# EAGLE design board (EAGLE 6.2)
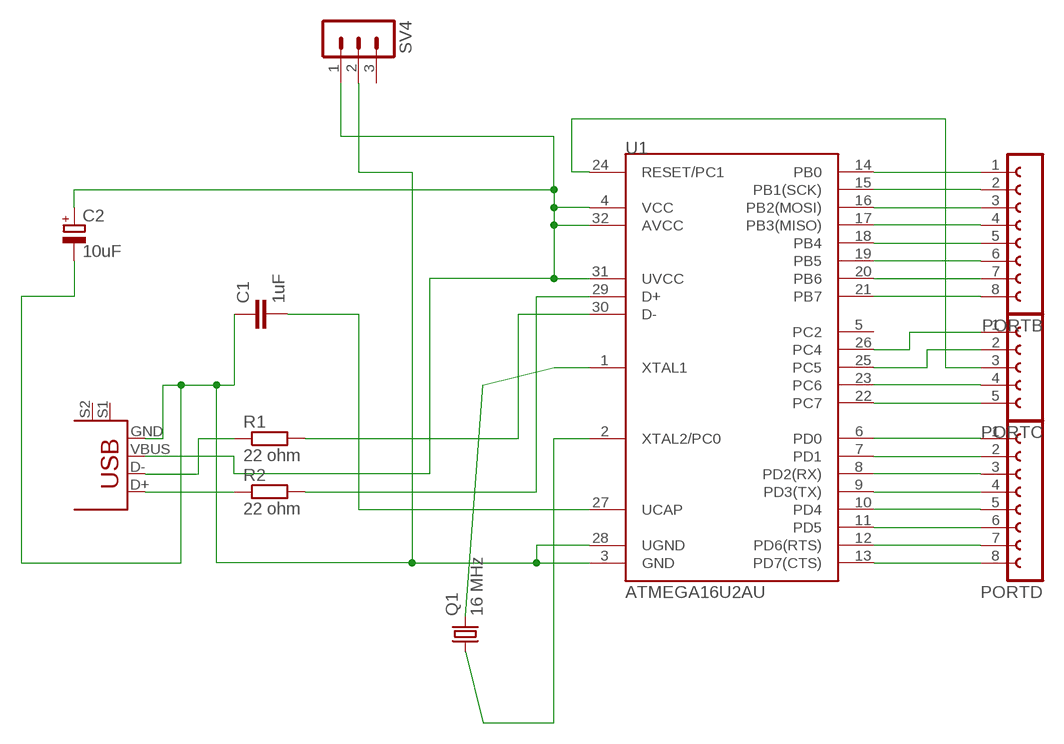
[diagram p0: schematic, sheet 1]

## Parts
C1  1uF  C-EU025-024X044  [C025-024X044]
C2  10uF  CPOL-EUE1.8-4  [E1,8-4]
PORTB  FE08-1  [FE08]
PORTC  FE05-1  [FE05-1]
PORTD  FE08-1  [FE08]
Q1  16 MHz  CRYSTALHC49S  [HC49/S]
R1  22 ohm  R-EU_0207/5V  [0207/5V]
R2  22 ohm  R-EU_0207/5V  [0207/5V]
SV4  MA03-1  [MA03-1]
U1  ATMEGA16U2AU  ATMEGA8U2AU  [TQFP32-08]
U$2  USB+SHIELD  [USB-B-PTH]

## Nets
N$1: R1.1 U$2.D-
N$2: PORTD.6 U1.11(PD5)
N$3: R2.1 U$2.D+
N$4: R1.2 U1.30(D-)
N$5: PORTB.2 U1.15(PB1(SCK))
N$6: C2.+ SV4.1 U1.4(VCC) U1.31(UVCC) U1.32(AVCC) U$2.VBUS
N$7: PORTB.4 U1.17(PB3(MISO))
N$8: Q1.2 U1.1(XTAL1)
N$9: Q1.1 U1.2(XTAL2/PC0)
N$10: C1.2 U1.27(UCAP)
N$11: R2.2 U1.29(D+)
N$12: PORTB.1 U1.14(PB0)
N$14: PORTB.5 U1.18(PB4)
N$15: PORTB.6 U1.19(PB5)
N$16: PORTB.7 U1.20(PB6)
N$17: PORTB.8 U1.21(PB7)
N$18: PORTD.8 U1.13(PD7(CTS))
N$19: PORTC.2 U1.25(PC5)
N$20: PORTC.1 U1.26(PC4)
N$21: PORTC.4 U1.23(PC6)
N$22: PORTC.5 U1.22(PC7)
N$23: PORTD.7 U1.12(PD6(RTS))
N$25: PORTD.5 U1.10(PD4)
N$26: PORTD.4 U1.9(PD3(TX))
N$27: PORTD.3 U1.8(PD2(RX))
N$28: PORTD.2 U1.7(PD1)
N$29: PORTD.1 U1.6(PD0)
N$30: C1.1 C2.- SV4.2 U1.3(GND) U1.28(UGND) U$2.GND
N$31: PORTB.3 U1.16(PB2(MOSI))
N$33: PORTC.3 U1.24(RESET/PC1)
Unconnected: SV4.3 U1.5(PC2) U$2.S1 U$2.S2

## Library data of the parts
C1 = rcl:C-EU: CAPACITOR, European symbol
C2 = rcl:CPOL-EU: POLARIZED CAPACITOR, European symbol
PORTB PORTD = con-lsta:FE08-1: FEMALE HEADER; OC_FARNELL: unknown; OC_NEWARK: unknown
PORTC = con-lsta:FE05-1: FEMALE HEADER; OC_FARNELL: unknown; OC_NEWARK: unknown
Q1 = crystal:CRYSTAL: CRYSTAL; OC_FARNELL: 1667008; OC_NEWARK: unknown
R1 R2 = rcl:R-EU_: RESISTOR, European symbol
SV4 = con-lstb:MA03-1: PIN HEADER; OC_FARNELL: unknown; OC_NEWARK: unknown
U1 = SparkFun:ATMEGA8U2: Atmel 8-bit Microcontroller with 8/16/32K Bystes of ISP Flash and USB Controller. ATmega8U2, ATmega16U2, and ATmega32U2
U$2 = SparkFun:USB+SHIELD: USB+Shield USB connector with shield pins connectable

## Board
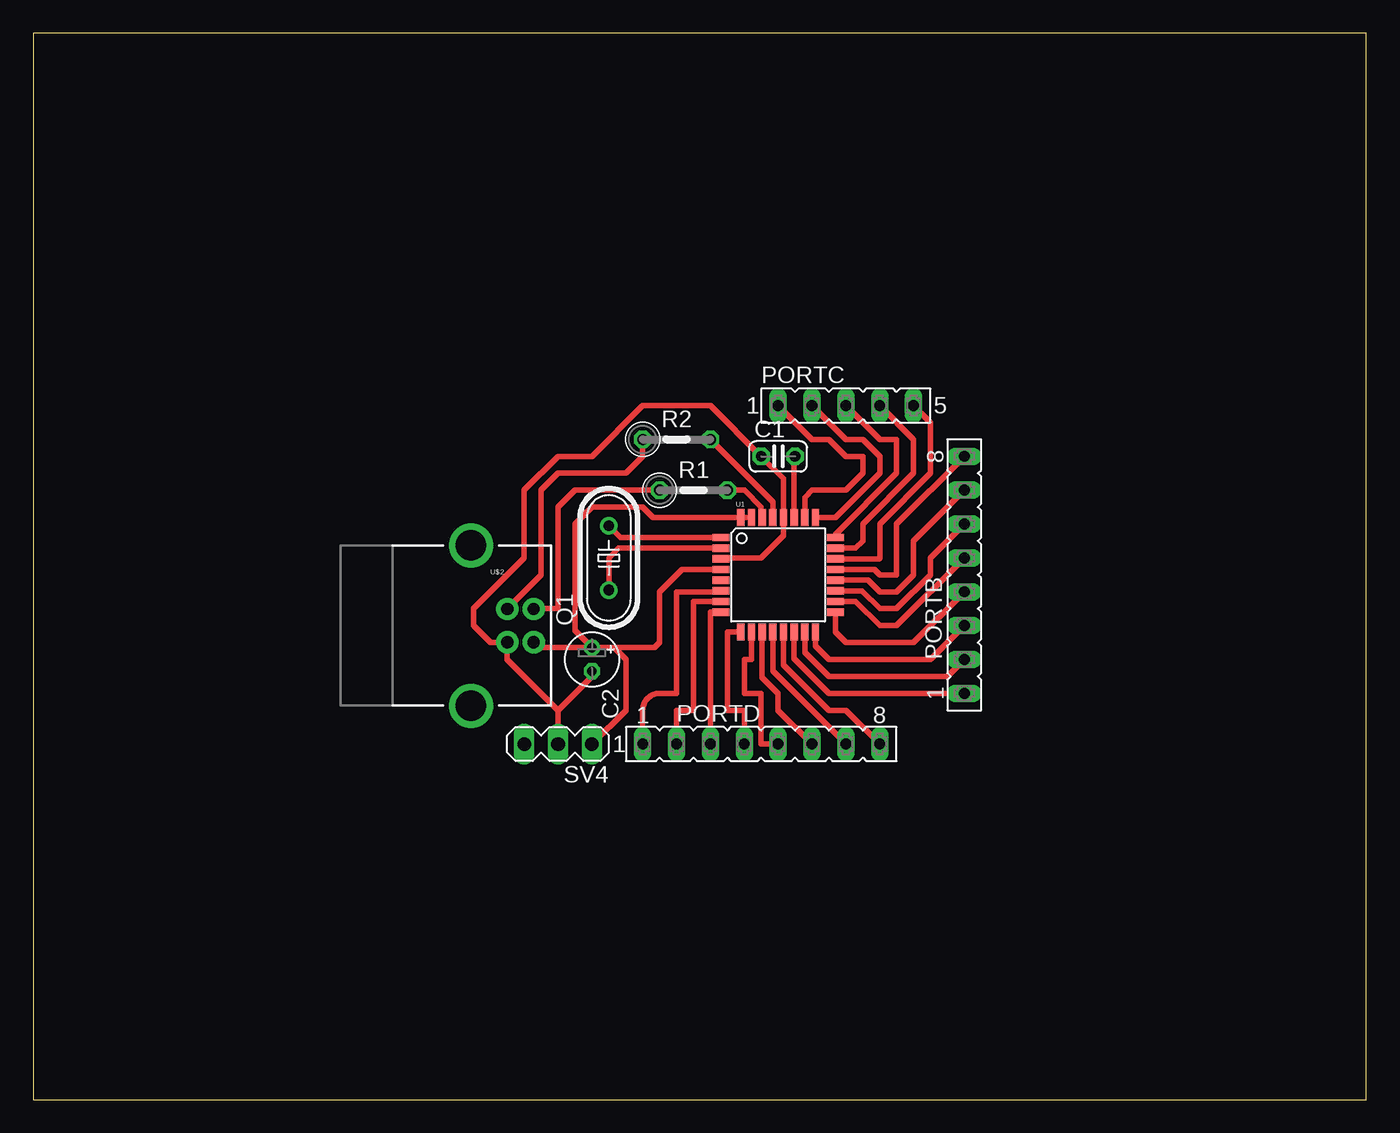
[diagram p1: board, top side]

Size 100 x 80 mm. Coordinates in mm from the lower left corner, seen from the top.
Outline: 0,0 100,0 100,80 0,80 0,0
Copper layers (1*16): Top 0.035mm / dielectric 1.5mm / Bottom 0.035mm
Design rules: minimum track width 10mil, minimum drill 24mil, track to track 8mil, track to pad 8mil, pad to pad 8mil, via to via 8mil, smd to smd 8mil, copper to edge 40mil, drill to drill 8mil, minimum pad ring 10mil, minimum via ring 8mil, stop-mask expansion 4mil, vias tented up to drill 0mil, thermal gap 10mil

### Footprints (pad centres in the part's own frame; a part is rotated, then mirrored left to right if it is on the bottom)
C025-024X044 = drill 0.813 octagon: 1 -1.27,0; 2 1.27,0
E1,8-4 = drill 0.711 pad 1.168: + -0.889,0 | drill 0.711 pad 1.168 octagon: - 0.889,0
FE08 = drill 0.813 long: 1 -8.89,0; 2 -6.35,0; 3 -3.81,0; 4 -1.27,0; 5 1.27,0; 6 3.81,0; 7 6.35,0; 8 8.89,0
FE05-1 = drill 0.813 long: 1 -5.08,0; 2 -2.54,0; 3 0,0; 4 2.54,0; 5 5.08,0
HC49/S = drill 0.813: 1 -2.413,0; 2 2.413,0
0207/5V = drill 0.813 octagon: 1 -2.54,0; 2 2.54,0
MA03-1 = drill 1.016 long: 1 -2.54,0; 2 0,0; 3 2.54,0
TQFP32-08 = smd 1.27 x 0.559: 1 -4.293,2.8; 2 -4.293,2; 3 -4.293,1.2; 4 -4.293,0.4; 5 -4.293,-0.4; 6 -4.293,-1.2; 7 -4.293,-2; 8 -4.293,-2.8; 17 4.293,-2.8; 18 4.293,-2; 19 4.293,-1.2; 20 4.293,-0.4; 21 4.293,0.4; 22 4.293,1.2; 23 4.293,2; 24 4.293,2.8 | smd 0.559 x 1.27: 9 -2.8,-4.293; 10 -2,-4.293; 11 -1.2,-4.293; 12 -0.4,-4.293; 13 0.4,-4.293; 14 1.2,-4.293; 15 2,-4.293; 16 2.8,-4.293; 25 2.8,4.293; 26 2,4.293; 27 1.2,4.293; 28 0.4,4.293; 29 -0.4,4.293; 30 -1.2,4.293; 31 -2,4.293; 32 -2.8,4.293
USB-B-PTH = drill 0.914 pad 1.676: D+ 0,1.25; D- 1.981,1.25; GND 0,-1.25; VBUS 1.981,-1.25 | drill 2.286: S1 -2.718,-6.02; S2 -2.718,6.02

### Placement (x,y rotation side)
C1  55.88,48.26 0 top
C2  41.91,33.02 270 top
PORTB  69.85,39.37 90 top
PORTC  60.96,52.07 0 top
PORTD  54.61,26.67 0 top
Q1  43.18,40.64 90 top
R1  49.53,45.72 0 top
R2  48.26,49.53 0 top
SV4  39.37,26.67 180 top
U1  55.88,39.37 0 top
U$2  35.56,35.56 0 top

### Tracks (layer width: path | path; a pad name or v marks a point on that pad's centre or on a via)
N$1
  Top 0.406: U$2.D- 37.56,36.83 39.37,36.83 39.37,44.45 40.64,45.72 R1.1
N$2
  Top 0.406: U1.11 54.68,31.68 55.88,30.48 55.88,29.21 PORTD.6
N$3
  Top 0.406: U$2.D+ 38.1,39.35 38.1,45.72 39.37,46.99 44.45,46.99 45.72,48.26 R2.1
N$4
  Top 0.406: R1.2 53.34,45.72 54.61,44.45 54.61,43.73 U1.30
N$5
  Top 0.406: U1.15 57.88,33.56 59.69,31.75 68.58,31.75 PORTB.2
N$6
  Top 0.406: SV4.1 44.45,29.21 44.45,33.02 43.56,33.91 C2.+ | C2.+ 46.61,33.91 46.99,34.29 46.99,38.1 48.66,39.77 U1.4 | C2.+ 40.64,35.18 40.64,43.18 41.91,44.45 45.72,44.45 46.51,43.66 U1.32 U1.31 | U$2.VBUS 37.94,33.91 C2.+
N$7
  Top 0.406: U1.17 60.17,35.08 60.96,34.29 66.04,34.29 PORTB.4
N$8
  Top 0.406: Q1.2 44.06,42.17 U1.1
N$9
  Top 0.406: Q1.1 43.18,40.64 43.91,41.37 U1.2
N$10
  Top 0.406: U1.27 57.08,48.19 C1.2
N$11
  Top 0.406: R2.2 55.48,44.85 U1.29
N$12
  Top 0.406: U1.14 57.08,33.09 59.69,30.48 PORTB.1
N$14
  Top 0.406: U1.18 61.69,37.37 63.5,35.56 64.77,35.56 PORTB.5
N$15
  Top 0.406: U1.19 62.16,38.17 63.5,36.83 64.77,36.83 67.31,39.37 67.31,40.64 PORTB.6
N$16
  Top 0.406: U1.20 62.63,38.97 63.5,38.1 64.77,38.1 66.04,39.37 66.04,41.91 PORTB.7
N$17
  Top 0.406: U1.21 63.1,39.77 63.5,39.37 64.77,39.37 64.77,43.18 PORTB.8
N$18
  Top 0.406: U1.13 56.28,32.62 59.69,29.21 60.96,29.21 PORTD.8
N$19
  Top 0.406: U1.25 60.17,43.66 63.5,46.99 63.5,48.26 62.23,49.53 60.96,49.53 PORTC.2
N$20
  Top 0.406: U1.26 57.88,45.18 58.42,45.72 60.96,45.72 62.23,46.99 62.23,48.26 60.96,48.26 59.69,49.53 58.42,49.53 PORTC.1
N$21
  Top 0.406: U1.23 61.69,41.37 62.23,41.91 62.23,43.18 66.04,46.99 66.04,49.53 PORTC.4
N$22
  Top 0.406: U1.22 63.43,40.57 63.5,40.64 63.5,43.18 67.31,46.99 67.31,50.8 PORTC.5
N$23
  Top 0.406: U1.12 55.48,32.15 PORTD.7
N$25
  Top 0.406: U1.10 53.88,33.02 53.34,33.02 53.34,30.48 54.61,30.48 54.61,26.67 PORTD.5
N$26
  Top 0.406: PORTD.4 53.34,29.21 52.07,29.21 52.07,35.08 U1.9
N$27
  Top 0.406: PORTD.3 50.8,36.57 U1.8
N$28
  Top 0.406: PORTD.2 48.26,29.21 49.53,29.21 49.53,37.37 U1.7
N$29
  Top 0.406: PORTD.1 45.72,29.21 arc-90 46.99,30.48 48.26,30.48 48.26,38.1 51.59,38.1 U1.6
N$30
  Top 0.406: SV4.2 39.37,29.21 | U$2.GND 35.56,34.29 | 35.56,34.29 35.56,33.02 39.37,29.21 | C2.- 41.91,31.75 39.37,29.21 | 35.56,34.29 34.29,34.29 33.02,35.56 33.02,36.83 36.83,40.64 36.83,45.72 39.37,48.26 41.91,48.26 45.72,52.07 50.8,52.07 C1.1 56.28,46.59 U1.28 56.28,42.31 54.61,40.64 51.66,40.64 U1.3
N$31
  Top 0.406: U1.16 58.68,34.03 59.69,33.02 67.31,33.02 PORTB.3
N$33
  Top 0.406: U1.24 60.17,42.39 64.77,46.99 64.77,49.53 63.5,49.53 PORTC.3